# Altium schematic sheet VX1010.schdoc
size 198 x 135 mm
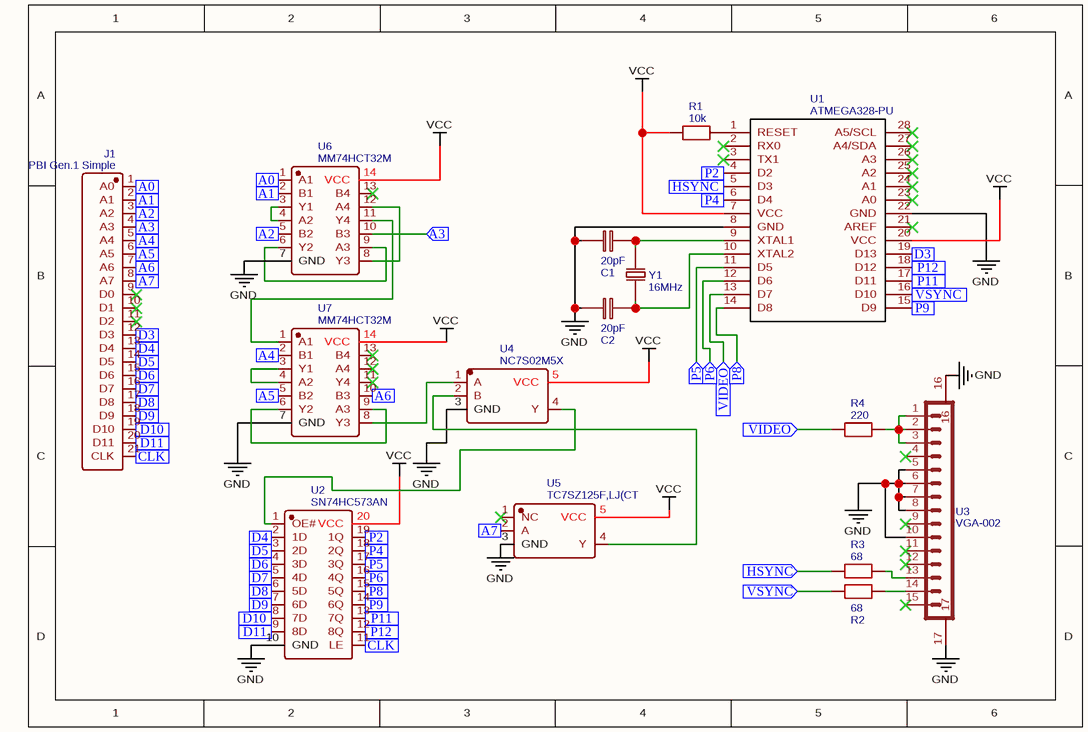
[diagram p0: VX1010.schdoc]

## Parts
C1  20pF  [RAD-0.1]
C2  20pF  [RAD-0.1]
J1  PBI Gen.1 Simple
R1  10k  [R_AXIAL-0.3]
R2  68  [R_AXIAL-0.3]
R3  68  [R_AXIAL-0.3]
R4  220  [R_AXIAL-0.3]
U1  ATMEGA328-PU  [ATMEGA328-PU]
U2  SN74HC573AN  [DIP-20_L26.8-W6.4-P2.54-LS7.6-BL]
U3  VGA-002  [D-SUB-TH_VGA-002]
U4  NC7S02M5X  [SOT-23-5_L3.0-W1.7-P0.95-LS2.8-BL]
U5  TC7SZ125F,LJ(CT  [SOT-23-5_L3.0-W1.7-P0.95-LS2.8-BL]
U6  MM74HCT32M  [SOIC-14_L8.7-W3.9-P1.27-LS6.0-BL]
U7  MM74HCT32M  [SOIC-14_L8.7-W3.9-P1.27-LS6.0-BL]
Y1  16MHz  [HC-49S]

## Ports
A0 (in), A1 (in), A2 (in), A3 (in), A4 (in), A5 (in), A6 (in), A7 (in), CLK (in), D3 (in), D4 (in), D5 (in), D6 (in), D7 (in), D8 (in), D9 (in), D10 (in), D11 (in), HSYNC (in), P2 (in), P4 (in), P5 (in), P6 (in), P8 (in), P9 (in), P11 (in), P12 (in), VIDEO (in), VSYNC (in)

## Nets
GND: C1.1 C2.1 U1.8(GND) U1.22(GND) U2.10(GND) U3.5 U3.6 U3.7 U3.8 U3.10 U3.16 U3.17 U4.3(GND) U5.3(GND) U6.7(GND) U7.7(GND)
VCC: R1.1 U1.7(VCC) U1.20(VCC) U2.20(VCC) U4.5(VCC) U5.5(VCC) U6.14(VCC) U7.14(VCC)
A0: J1.1(A0) U6.1(A1) ; port A0
A1: J1.2(A1) U6.2(B1) ; port A1
A2: J1.3(A2) U6.5(B2) ; port A2
A3: J1.4(A3) U6.10(B3) ; port A3
A4: J1.5(A4) U7.2(B1) ; port A4
A5: J1.6(A5) U7.5(B2) ; port A5
A6: J1.7(A6) U7.10(B3) ; port A6
A7: J1.8(A7) U5.2(A) ; port A7
CLK: J1.21(CLK) U2.11(LE) ; port CLK
D3: J1.12(D3) U1.19(D13) ; port D3
D4: J1.13(D4) U2.2(1D) ; port D4
D5: J1.14(D5) U2.3(2D) ; port D5
D6: J1.15(D6) U2.4(3D) ; port D6
D7: J1.16(D7) U2.5(4D) ; port D7
D8: J1.17(D8) U2.6(5D) ; port D8
D9: J1.18(D9) U2.7(6D) ; port D9
D10: J1.19(D10) U2.8(7D) ; port D10
D11: J1.20(D11) U2.9(8D) ; port D11
HSYNC: R3.1 U1.5(D3) ; port HSYNC
P2: U1.4(D2) U2.19(1Q) ; port P2
P4: U1.6(D4) U2.18(2Q) ; port P4
P5: U1.11(D5) U2.17(3Q) ; port P5
P6: U1.12(D6) U2.16(4Q) ; port P6
P8: U1.14(D8) U2.15(5Q) ; port P8
P9: U1.15(D9) U2.14(6Q) ; port P9
P11: U1.17(D11) U2.13(7Q) ; port P11
P12: U1.18(D12) U2.12(8Q) ; port P12
VIDEO: R4.1 U1.13(D7) ; port VIDEO
VSYNC: R2.1 U1.16(D10) ; port VSYNC
NetC1_2: C1.2 U1.9(XTAL1) Y1.1
NetC2_2: C2.2 U1.10(XTAL2) Y1.2
NetR1_2: R1.2 U1.1(RESET)
NetR2_2: R2.2 U3.14
NetR3_2: R3.2 U3.13
NetR4_2: R4.2 U3.1 U3.2 U3.3
NetU2_1: U2.1(OE#) U4.4(Y)
NetU4_1: U4.1(A) U7.8(Y3)
NetU4_2: U4.2(B) U5.4(Y)
NetU6_3: U6.3(Y1) U6.4(A2)
NetU6_6: U6.6(Y2) U6.9(A3)
NetU6_8: U6.8(Y3) U6.12(A4)
NetU6_11: U6.11(Y4) U7.1(A1)
NetU7_3: U7.3(Y1) U7.4(A2)
NetU7_6: U7.6(Y2) U7.9(A3)

Not connected (* = marked no-connect by the designer): J1 9(D0)* 10(D1)* 11(D2)*; U1 2(RX0)* 3(TX1)* 21(AREF)* 23(A0)* 24(A1)* 25(A2)* 26(A3)* 27(A4/SDA)* 28(A5/SCL)*; U3 4* 9* 11* 12* 15*; U5 1(NC)*; U6 13(B4)*; U7 11(Y4)* 12(A4)* 13(B4)*

## Library data of the parts
C1 C2 = 20pF: nameAlias: Value(F); Contributor: LCEDA_Lib; spicePre: C; spiceSymbolName: C_RAD-0.1_EU
R1 = 10k: nameAlias: Value(Ω); Contributor: LCEDA_Lib; spicePre: R; spiceSymbolName: R_AXIAL-0.3_EU
R2 R3 = 68: nameAlias: Value(Ω); Contributor: LCEDA_Lib; spicePre: R; spiceSymbolName: R_AXIAL-0.3_EU
R4 = 220: nameAlias: Value(Ω); Contributor: LCEDA_Lib; spicePre: R; spiceSymbolName: R_AXIAL-0.3_EU
U1 = ATMEGA328-PU: Contributor: Sopian; sourceId: 3rfdaKkiS; timeStamp: 1473211392; spicePre: U; spiceSymbolName: ATMEGA328-PU 28 PINSET
U2 = SN74HC573AN: Manufacturer: TI; Contributor: Rubber_BeQi; spicePre: X; Supplier: LCSC; Manufacturer Part: SN74HC573AN; image: //image.lceda.cn/szlcsc/C5196.jpg; Supplier Part: C5196; spiceSymbolName: SN74HC573AN
U3 = VGA-002: Manufacturer: BOOMELE(博穆精密); Supplier: LCSC; Manufacturer Part: VGA-002; Supplier Part: C138387; JLCPCB Part Class: Extended Part; spicePre: D; spiceSymbolName: VGA-002
U4 = NC7S02M5X: Manufacturer: onsemi(安森美); Contributor: LCSC; Supplier: LCSC; Supplier Part: C112083; Manufacturer Part: NC7S02M5X; JLCPCB Part Class: Extended Part; spicePre: U; spiceSymbolName: NC7S02M5X
U5 = TC7SZ125F,LJ(CT: Manufacturer: TOSHIBA(东芝); Contributor: LCSC; Supplier: LCSC; Supplier Part: C2675515; Manufacturer Part: TC7SZ125F,LJ(CT; JLCPCB Part Class: Extended Part; spicePre: U; spiceSymbolName: TC7SZ125F,LJ(CT
U6 U7 = MM74HCT32M: Manufacturer: onsemi(安森美); Contributor: LCSC; Supplier: LCSC; Supplier Part: C897305; Manufacturer Part: MM74HCT32M; JLCPCB Part Class: Extended Part; spicePre: U; spiceSymbolName: MM74HCT32M
Y1 = 16MHz: Manufacturer: ABRACON; Manufacturer Part: ABL-16.000MHZ-B2; nameAlias: Frequency; Contributor: abduladam; Supplier: Mouser; Supplier Part: 815-ABL-16-B2; spicePre: X; spiceSymbolName: X49SSM16MSD2SI
J1 = PBI Gen.1 Simple: spicePre: X; spiceSymbolName: PBI Gen.1 Simple